# EAGLE design RGB (EAGLE 5.10)
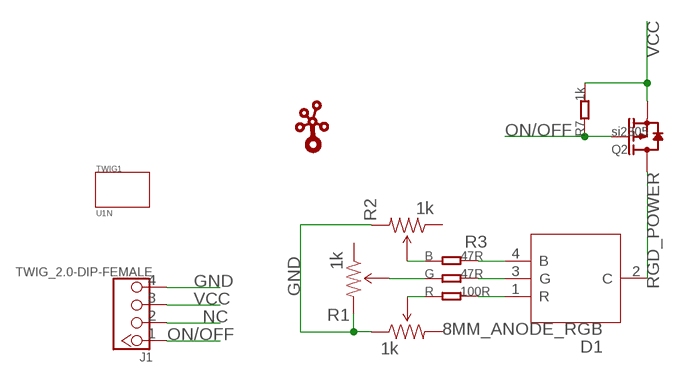
[diagram p0: schematic, sheet 1]

## Parts
B  47R  005-R0603_S  [0603_S]
D1  8MM_ANODE_RGB  007-RGB-3P-DIP  [007-RGB-3P-DIP]
G  47R  005-R0603_S  [0603_S]
J1  TWIG_2.0-DIP-FEMALE  [2.0_1X4]
Q2  si2305  014-P-MOSFETSOT23  [SOT23_]
R  100R  005-R0603_S  [0603_S]
R1  1k  005-TRIMPOTSMD  [TRIMPOT-3MM]
R2  1k  005-TRIMPOTSMD  [TRIMPOT-3MM]
R3  1k  005-TRIMPOTSMD  [TRIMPOT-3MM]
R7  1k  005-R0603_S  [0603_S]
TWIG1  U1N  [U1N]
U$1  TWIGLOGOTWIGLOGO_SMALL  [TWIGLOGO_SMALL]

## Nets
GND: J1.4 R1.1(CCW) R2.3(CW) R3.3(CW)
N$1: D1.1(R) R.2
N$2: D1.3(G) G.2
N$3: B.2 D1.4(B)
N$4: G.1 R2.2(WIPER)
N$5: R1.2(WIPER) R.1
N$6: B.1 R3.2(WIPER)
NC: J1.2
ON/OFF: J1.1 Q2.1(G) R7.1
RGD_POWER: D1.2(C) Q2.3(D)
VCC: J1.3 Q2.2(S) R7.2
Unconnected: R1.3(CW) R2.1(CCW) R3.1(CCW)

## Library data of the parts
B G R R7 = Discrete:005-R*
D1 = Discrete:007-RGB-3P-DIP
J1 = Connector:TWIG_2.0-DIP-FEMALE
Q2 = Discrete:014-P-MOSFET*: Si2305DS Si2323CDS
R1-R3 = Discrete:005-TRIMPOT
TWIG1 = EXT_moudle:U1N
U$1 = seeedleo:TWIGLOGO

## Net classes
0 default: width 0.203 mm, drill 0.305 mm, clearance 0.203 mm

## Board
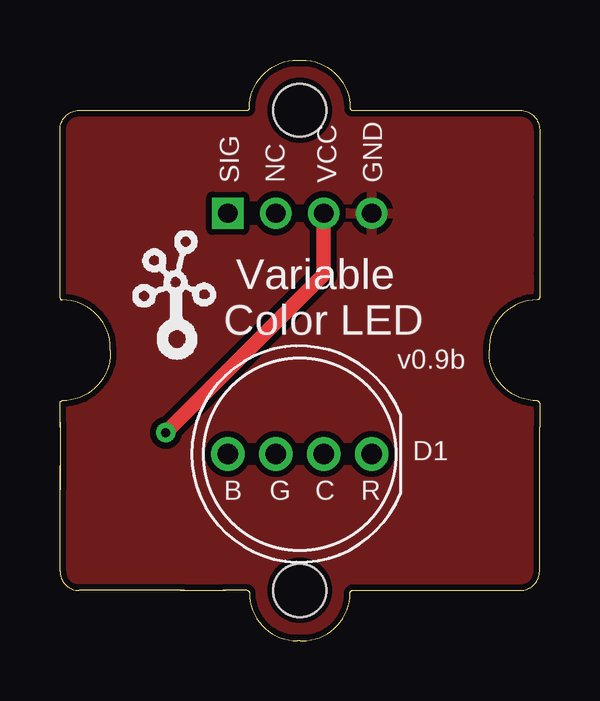
[diagram p1: board, top side]
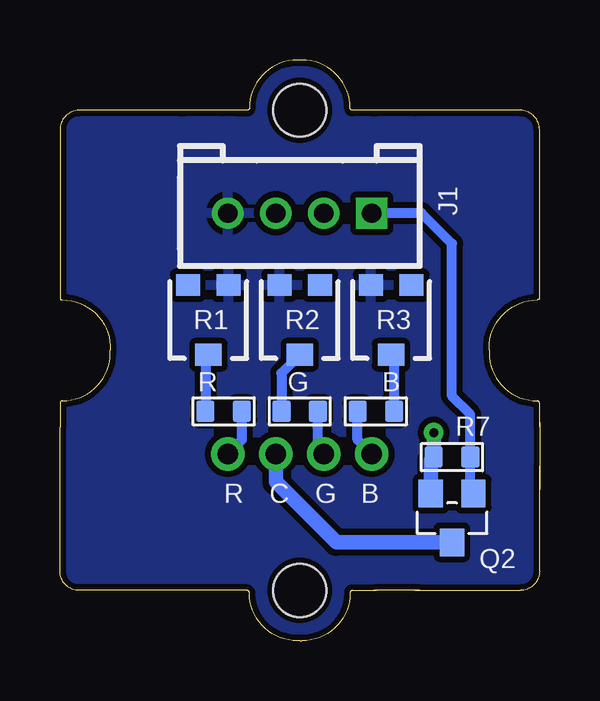
[diagram p2: board, bottom side, seen from below]

Size 20 x 24.2 mm. Coordinates in mm from the lower left corner, seen from the top.
Copper layers (1*16): Top 0.035mm / dielectric 1.5mm / Bottom 0.035mm
Design rules "SeeedStudio_rule_no_angle_090911": minimum track width 6mil, minimum drill 12mil, track to track 6mil, track to pad 6mil, pad to pad 6mil, via to via 6mil, smd to smd 0mil, copper to edge 10mil, drill to drill 10mil, minimum pad ring 10mil, minimum via ring 6mil, stop-mask expansion 2mil, vias tented up to drill 100mil, thermal gap 10mil

### Footprints (pad centres in the part's own frame; a part is rotated, then mirrored left to right if it is on the bottom)
0603_S = smd 0.762 x 0.889: 1 -0.762,0; 2 0.762,0
007-RGB-3P-DIP = drill 0.85 pad 1.4 round: 1 3,0; 2 1,0; 3 -1,0; 4 -3,0
2.0_1X4 = drill 0.8 pad 1.27 square: 1 -3,0 | drill 0.8 pad 1.27 round: 2 -1,0; 3 1,0; 4 3,0
SOT23_ = smd 1.016 x 1.143: 1 -0.889,-1.016; 2 0.889,-1.016; 3 0,1.016
TRIMPOT-3MM = smd 1 x 0.9: 1 -0.85,-1.45; 3 0.85,-1.45 | smd 1.1 x 0.9: 2 0,1.45
U1N = hole 2.2: 0,-10; 0,10

### Placement (x,y rotation side)
B  6.82,9.56 180 bottom
D1  10,7.78 0 top
G  10,9.56 0 bottom
J1  10,17.81 180 bottom
Q2  3.65,5.12 180 bottom
R  13.17,9.56 0 bottom
R1  13.81,13.37 180 bottom
R2  10,13.37 180 bottom
R3  6.19,13.37 180 bottom
R7  3.65,7.66 180 bottom
TWIG1  10,12.1 0 top
U$1  2.63,11.59 0 top

### Tracks (layer width: path | path; a pad name or v marks a point on that pad's centre or on a via)
GND
  pour Top (isolate 0.254): -0.16,24.16 20.16,24.16 20.16,0.04 -0.16,0.04
  pour Bottom (isolate 0.254): -0.16,24.16 20.16,24.16 20.16,0.04 -0.16,0.04
N$1
  Bottom 0.406: R.2 12.41,8.37 D1.1
N$2
  Bottom 0.406: G.2 9.24,8.02 D1.3
N$3
  Bottom 0.406: B.2 7.59,8.37 D1.4
N$4
  Bottom 0.406: G.1 10.76,11.16 R2.2
N$5
  Bottom 0.406: R.1 13.94,11.79 R1.2
N$6
  Bottom 0.406: B.1 6.06,11.79 R3.2
ON/OFF
  Bottom 0.406: J1.1 4.92,17.81 3.65,16.55 3.65,10.2 2.89,9.43 R7.1 2.89,6.26 Q2.1
RGD_POWER
  Bottom 0.61: D1.2 11,6.62 8.48,4.1 Q2.3
VCC  (via drill 0.38 pad 0.81)
  Top 0.61: J1.3 11,15.26 v4.41,8.67
  Bottom 0.406: 4.54,7.53 R7.2 4.54,7.53
  Bottom 0.61: Q2.2 4.54,7.53 | R7.2 v4.41,8.67

### Text on the board
tPlace: SIG | NC | VCC | GND | Variable | Color LED | v0.9b
bPlace: B | G | C | R